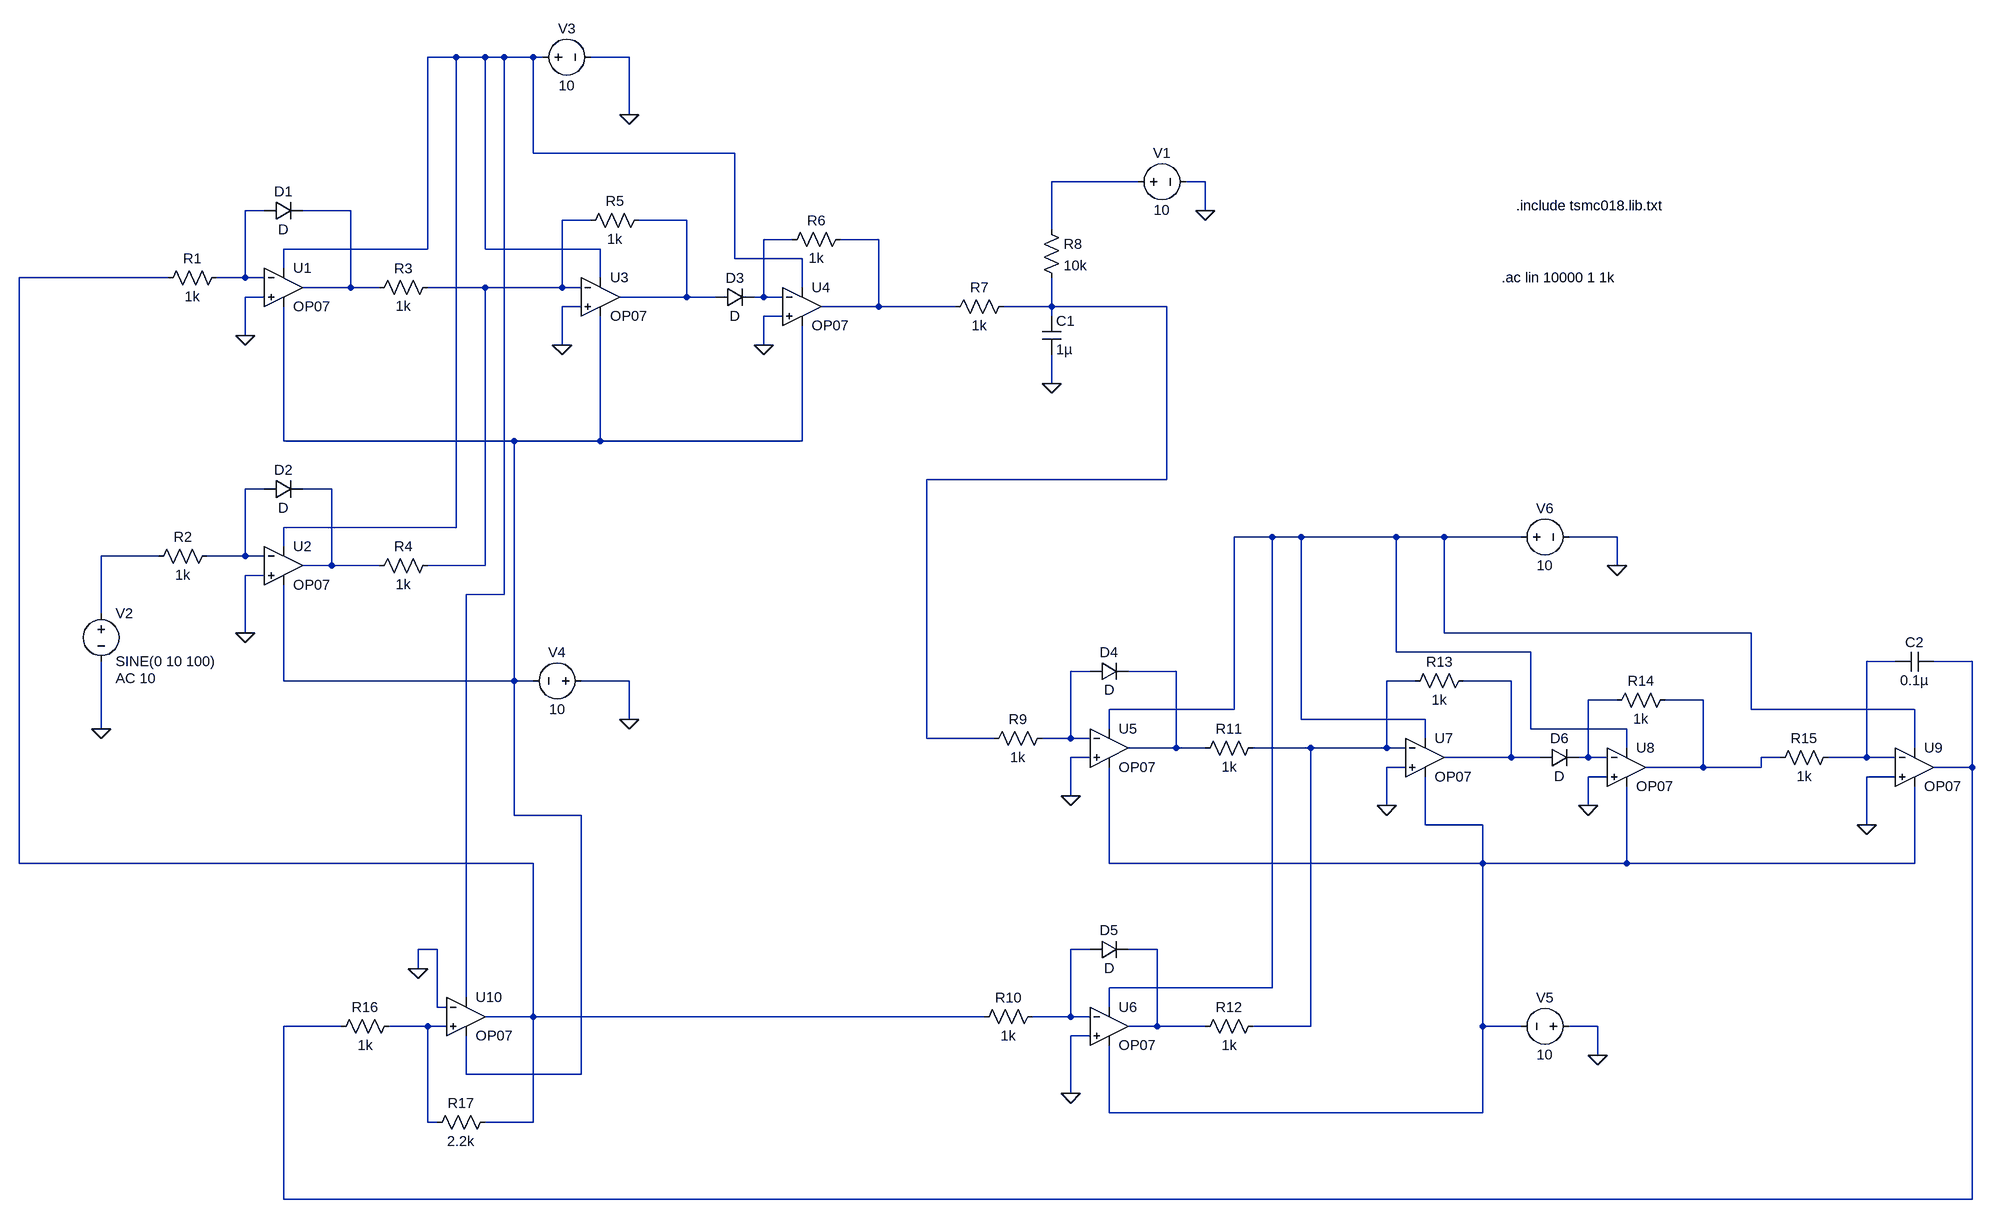
[diagram p0: schematic PLL Design Project.asc]
PLL Design Project.asc, the LTspice schematic file:
Version 4
SHEET 1 2996 1684
WIRE 352 -224 304 -224
WIRE 400 -224 352 -224
WIRE 432 -224 400 -224
WIRE 480 -224 432 -224
WIRE 496 -224 480 -224
WIRE 640 -224 576 -224
WIRE 640 -128 640 -224
WIRE 480 -64 480 -224
WIRE 816 -64 480 -64
WIRE 1488 -16 1344 -16
WIRE 1600 -16 1568 -16
WIRE 32 32 0 32
WIRE 176 32 96 32
WIRE 1600 32 1600 -16
WIRE 576 48 528 48
WIRE 736 48 656 48
WIRE 1344 64 1344 -16
WIRE 912 80 864 80
WIRE 1056 80 992 80
WIRE 304 96 304 -224
WIRE 304 96 64 96
WIRE 400 96 400 -224
WIRE 592 96 400 96
WIRE 816 112 816 -64
WIRE 928 112 816 112
WIRE 64 128 64 96
WIRE -128 144 -560 144
WIRE 0 144 0 32
WIRE 0 144 -48 144
WIRE 32 144 0 144
WIRE 592 144 592 96
WIRE 176 160 176 32
WIRE 176 160 96 160
WIRE 224 160 176 160
WIRE 400 160 304 160
WIRE 528 160 528 48
WIRE 528 160 400 160
WIRE 560 160 528 160
WIRE 928 160 928 112
WIRE 32 176 0 176
WIRE 736 176 736 48
WIRE 736 176 624 176
WIRE 784 176 736 176
WIRE 864 176 864 80
WIRE 864 176 848 176
WIRE 896 176 864 176
WIRE 560 192 528 192
WIRE 1056 192 1056 80
WIRE 1056 192 960 192
WIRE 1184 192 1056 192
WIRE 1344 192 1344 144
WIRE 1344 192 1264 192
WIRE 1536 192 1344 192
WIRE 896 208 864 208
WIRE 1344 208 1344 192
WIRE 0 240 0 176
WIRE 528 256 528 192
WIRE 864 256 864 208
WIRE 1344 320 1344 272
WIRE 64 416 64 192
WIRE 448 416 64 416
WIRE 592 416 592 208
WIRE 592 416 448 416
WIRE 928 416 928 224
WIRE 928 416 592 416
WIRE 1536 480 1536 192
WIRE 1536 480 1136 480
WIRE 32 496 0 496
WIRE 144 496 96 496
WIRE 352 560 352 -224
WIRE 352 560 64 560
WIRE 1712 576 1648 576
WIRE 1760 576 1712 576
WIRE 1920 576 1760 576
WIRE 2000 576 1920 576
WIRE 2128 576 2000 576
WIRE 2288 576 2208 576
WIRE 64 592 64 560
WIRE -144 608 -240 608
WIRE 0 608 0 496
WIRE 0 608 -64 608
WIRE 32 608 0 608
WIRE 144 624 144 496
WIRE 144 624 96 624
WIRE 224 624 144 624
WIRE 400 624 400 160
WIRE 400 624 304 624
WIRE 2288 624 2288 576
WIRE 32 640 0 640
WIRE 432 672 432 -224
WIRE 432 672 368 672
WIRE -240 704 -240 608
WIRE 0 736 0 640
WIRE 2000 736 2000 576
WIRE 2512 736 2000 736
WIRE 1920 768 1920 576
WIRE 2144 768 1920 768
WIRE 2752 784 2704 784
WIRE 2880 784 2816 784
WIRE 1408 800 1376 800
WIRE 1552 800 1472 800
WIRE 64 816 64 656
WIRE 448 816 448 416
WIRE 448 816 64 816
WIRE 480 816 448 816
WIRE 640 816 560 816
WIRE 1952 816 1904 816
WIRE 2112 816 2032 816
WIRE 2288 848 2240 848
WIRE 2432 848 2368 848
WIRE 1648 864 1648 576
WIRE 1648 864 1440 864
WIRE 2512 864 2512 736
WIRE 2784 864 2512 864
WIRE 640 880 640 816
WIRE 1760 880 1760 576
WIRE 1968 880 1760 880
WIRE -240 896 -240 784
WIRE 1440 896 1440 864
WIRE 2144 896 2144 768
WIRE 2304 896 2144 896
WIRE 1136 912 1136 480
WIRE 1248 912 1136 912
WIRE 1376 912 1376 800
WIRE 1376 912 1328 912
WIRE 1408 912 1376 912
WIRE 1968 912 1968 880
WIRE 1552 928 1552 800
WIRE 1552 928 1472 928
WIRE 1600 928 1552 928
WIRE 1776 928 1680 928
WIRE 1904 928 1904 816
WIRE 1904 928 1776 928
WIRE 1936 928 1904 928
WIRE 2304 928 2304 896
WIRE 2784 928 2784 864
WIRE 1408 944 1376 944
WIRE 2112 944 2112 816
WIRE 2112 944 2000 944
WIRE 2160 944 2112 944
WIRE 2240 944 2240 848
WIRE 2240 944 2224 944
WIRE 2272 944 2240 944
WIRE 2560 944 2528 944
WIRE 2704 944 2704 784
WIRE 2704 944 2640 944
WIRE 2752 944 2704 944
WIRE 1936 960 1904 960
WIRE 2432 960 2432 848
WIRE 2432 960 2336 960
WIRE 2528 960 2528 944
WIRE 2528 960 2432 960
WIRE 2880 960 2880 784
WIRE 2880 960 2816 960
WIRE 2272 976 2240 976
WIRE 2752 976 2704 976
WIRE 1376 1008 1376 944
WIRE 1904 1024 1904 960
WIRE 2240 1024 2240 976
WIRE 448 1040 448 816
WIRE 560 1040 448 1040
WIRE 1968 1056 1968 976
WIRE 2064 1056 1968 1056
WIRE 2704 1056 2704 976
WIRE -560 1120 -560 144
WIRE 480 1120 -560 1120
WIRE 1440 1120 1440 960
WIRE 2064 1120 2064 1056
WIRE 2064 1120 1440 1120
WIRE 2304 1120 2304 992
WIRE 2304 1120 2064 1120
WIRE 2784 1120 2784 992
WIRE 2784 1120 2304 1120
WIRE 320 1264 288 1264
WIRE 1408 1264 1376 1264
WIRE 1520 1264 1472 1264
WIRE 288 1296 288 1264
WIRE 1712 1328 1712 576
WIRE 1712 1328 1440 1328
WIRE 368 1344 368 672
WIRE 320 1360 320 1264
WIRE 336 1360 320 1360
WIRE 1440 1360 1440 1328
WIRE 480 1376 480 1120
WIRE 480 1376 400 1376
WIRE 1232 1376 480 1376
WIRE 1376 1376 1376 1264
WIRE 1376 1376 1312 1376
WIRE 1408 1376 1376 1376
WIRE 160 1392 64 1392
WIRE 304 1392 240 1392
WIRE 336 1392 304 1392
WIRE 1520 1392 1520 1264
WIRE 1520 1392 1472 1392
WIRE 1600 1392 1520 1392
WIRE 1776 1392 1776 928
WIRE 1776 1392 1680 1392
WIRE 2064 1392 2064 1120
WIRE 2128 1392 2064 1392
WIRE 2256 1392 2208 1392
WIRE 1408 1408 1376 1408
WIRE 2256 1440 2256 1392
WIRE 368 1472 368 1408
WIRE 560 1472 560 1040
WIRE 560 1472 368 1472
WIRE 1376 1504 1376 1408
WIRE 1440 1536 1440 1424
WIRE 2064 1536 2064 1392
WIRE 2064 1536 1440 1536
WIRE 304 1552 304 1392
WIRE 320 1552 304 1552
WIRE 480 1552 480 1376
WIRE 480 1552 400 1552
WIRE 64 1680 64 1392
WIRE 2880 1680 2880 960
WIRE 2880 1680 64 1680
FLAG 0 240 0
FLAG 0 736 0
FLAG 528 256 0
FLAG 864 256 0
FLAG 1344 320 0
FLAG 1600 32 0
FLAG 1376 1008 0
FLAG 1376 1504 0
FLAG 1904 1024 0
FLAG 2240 1024 0
FLAG 2704 1056 0
FLAG 288 1296 0
FLAG -240 896 0
FLAG 640 -128 0
FLAG 640 880 0
FLAG 2288 624 0
FLAG 2256 1440 0
SYMBOL res -32 128 R90
WINDOW 0 0 56 VBottom 2
WINDOW 3 32 56 VTop 2
SYMATTR InstName R1
SYMATTR Value 1k
SYMBOL OpAmps\\OP07 64 96 R0
SYMATTR InstName U1
SYMBOL OpAmps\\OP07 64 560 R0
SYMATTR InstName U2
SYMBOL res -48 592 R90
WINDOW 0 0 56 VBottom 2
WINDOW 3 32 56 VTop 2
SYMATTR InstName R2
SYMATTR Value 1k
SYMBOL diode 32 48 R270
WINDOW 0 32 32 VTop 2
WINDOW 3 0 32 VBottom 2
SYMATTR InstName D1
SYMBOL diode 32 512 R270
WINDOW 0 32 32 VTop 2
WINDOW 3 0 32 VBottom 2
SYMATTR InstName D2
SYMBOL res 320 144 R90
WINDOW 0 0 56 VBottom 2
WINDOW 3 32 56 VTop 2
SYMATTR InstName R3
SYMATTR Value 1k
SYMBOL res 320 608 R90
WINDOW 0 0 56 VBottom 2
WINDOW 3 32 56 VTop 2
SYMATTR InstName R4
SYMATTR Value 1k
SYMBOL OpAmps\\OP07 592 112 R0
SYMATTR InstName U3
SYMBOL res 672 32 R90
WINDOW 0 0 56 VBottom 2
WINDOW 3 32 56 VTop 2
SYMATTR InstName R5
SYMATTR Value 1k
SYMBOL diode 784 192 R270
WINDOW 0 32 32 VTop 2
WINDOW 3 0 32 VBottom 2
SYMATTR InstName D3
SYMBOL OpAmps\\OP07 928 128 R0
SYMATTR InstName U4
SYMBOL res 1008 64 R90
WINDOW 0 0 56 VBottom 2
WINDOW 3 32 56 VTop 2
SYMATTR InstName R6
SYMATTR Value 1k
SYMBOL res 1280 176 R90
WINDOW 0 0 56 VBottom 2
WINDOW 3 32 56 VTop 2
SYMATTR InstName R7
SYMATTR Value 1k
SYMBOL cap 1328 208 R0
SYMATTR InstName C1
SYMATTR Value 1µ
SYMBOL res 1328 48 R0
SYMATTR InstName R8
SYMATTR Value 10k
SYMBOL voltage 1472 -16 R270
WINDOW 0 32 56 VTop 2
WINDOW 3 -32 56 VBottom 2
WINDOW 123 0 0 Left 0
WINDOW 39 0 0 Left 0
SYMATTR InstName V1
SYMATTR Value 10
SYMBOL res 1344 896 R90
WINDOW 0 0 56 VBottom 2
WINDOW 3 32 56 VTop 2
SYMATTR InstName R9
SYMATTR Value 1k
SYMBOL OpAmps\\OP07 1440 864 R0
SYMATTR InstName U5
SYMBOL OpAmps\\OP07 1440 1328 R0
SYMATTR InstName U6
SYMBOL res 1328 1360 R90
WINDOW 0 0 56 VBottom 2
WINDOW 3 32 56 VTop 2
SYMATTR InstName R10
SYMATTR Value 1k
SYMBOL diode 1408 816 R270
WINDOW 0 32 32 VTop 2
WINDOW 3 0 32 VBottom 2
SYMATTR InstName D4
SYMBOL diode 1408 1280 R270
WINDOW 0 32 32 VTop 2
WINDOW 3 0 32 VBottom 2
SYMATTR InstName D5
SYMBOL res 1696 912 R90
WINDOW 0 0 56 VBottom 2
WINDOW 3 32 56 VTop 2
SYMATTR InstName R11
SYMATTR Value 1k
SYMBOL res 1696 1376 R90
WINDOW 0 0 56 VBottom 2
WINDOW 3 32 56 VTop 2
SYMATTR InstName R12
SYMATTR Value 1k
SYMBOL OpAmps\\OP07 1968 880 R0
SYMATTR InstName U7
SYMBOL res 2048 800 R90
WINDOW 0 0 56 VBottom 2
WINDOW 3 32 56 VTop 2
SYMATTR InstName R13
SYMATTR Value 1k
SYMBOL diode 2160 960 R270
WINDOW 0 32 32 VTop 2
WINDOW 3 0 32 VBottom 2
SYMATTR InstName D6
SYMBOL OpAmps\\OP07 2304 896 R0
SYMATTR InstName U8
SYMBOL res 2384 832 R90
WINDOW 0 0 56 VBottom 2
WINDOW 3 32 56 VTop 2
SYMATTR InstName R14
SYMATTR Value 1k
SYMBOL res 2656 928 R90
WINDOW 0 0 56 VBottom 2
WINDOW 3 32 56 VTop 2
SYMATTR InstName R15
SYMATTR Value 1k
SYMBOL OpAmps\\OP07 2784 896 R0
SYMATTR InstName U9
SYMBOL cap 2752 800 R270
WINDOW 0 32 32 VTop 2
WINDOW 3 0 32 VBottom 2
SYMATTR InstName C2
SYMATTR Value 0.1µ
SYMBOL OpAmps\\OP07 368 1312 R0
SYMATTR InstName U10
SYMBOL res 256 1376 R90
WINDOW 0 0 56 VBottom 2
WINDOW 3 32 56 VTop 2
SYMATTR InstName R16
SYMATTR Value 1k
SYMBOL res 416 1536 R90
WINDOW 0 0 56 VBottom 2
WINDOW 3 32 56 VTop 2
SYMATTR InstName R17
SYMATTR Value 2.2k
SYMBOL voltage -240 688 R0
WINDOW 123 24 124 Left 2
WINDOW 39 0 0 Left 0
SYMATTR InstName V2
SYMATTR Value SINE(0 10 100)
SYMATTR Value2 AC 10
SYMBOL voltage 480 -224 R270
WINDOW 0 32 56 VTop 2
WINDOW 3 -32 56 VBottom 2
WINDOW 123 0 0 Left 0
WINDOW 39 0 0 Left 0
SYMATTR InstName V3
SYMATTR Value 10
SYMBOL voltage 576 816 R90
WINDOW 0 -32 56 VBottom 2
WINDOW 3 32 56 VTop 2
WINDOW 123 0 0 Left 0
WINDOW 39 0 0 Left 0
SYMATTR InstName V4
SYMATTR Value 10
SYMBOL voltage 2224 1392 R90
WINDOW 0 -32 56 VBottom 2
WINDOW 3 32 56 VTop 2
WINDOW 123 0 0 Left 0
WINDOW 39 0 0 Left 0
SYMATTR InstName V5
SYMATTR Value 10
SYMBOL voltage 2112 576 R270
WINDOW 0 32 56 VTop 2
WINDOW 3 -32 56 VBottom 2
WINDOW 123 0 0 Left 0
WINDOW 39 0 0 Left 0
SYMATTR InstName V6
SYMATTR Value 10
TEXT 2120 24 Left 2 !.include tsmc018.lib.txt
TEXT 2096 144 Left 2 !.ac lin 10000 1 1k

The netlist it stands for:
* PLL Design Project.asc
R1 N003 N009 1k
XU1 0 N003 N001 N011 N004 LT1001  ; OP07, pins In+ In- V+ V- OUT
XU2 0 N012 N001 N011 N013 LT1001  ; OP07, pins In+ In- V+ V- OUT
R2 N012 N015 1k
D1 N003 N004 D
D2 N012 N013 D
R3 N005 N004 1k
R4 N005 N013 1k
XU3 0 N005 N001 N011 N006 LT1001  ; OP07, pins In+ In- V+ V- OUT
R5 N006 N005 1k
D3 N006 N007 D
XU4 0 N007 N001 N011 N008 LT1001  ; OP07, pins In+ In- V+ V- OUT
R6 N008 N007 1k
R7 N010 N008 1k
C1 N010 0 1µ
R8 N002 N010 10k
V1 N002 0 10
R9 N018 N010 1k
XU5 0 N018 N014 N024 N019 LT1001  ; OP07, pins In+ In- V+ V- OUT
XU6 0 N025 N014 N024 N026 LT1001  ; OP07, pins In+ In- V+ V- OUT
R10 N025 N009 1k
D4 N018 N019 D
D5 N025 N026 D
R11 N020 N019 1k
R12 N020 N026 1k
XU7 0 N020 N014 N024 N021 LT1001  ; OP07, pins In+ In- V+ V- OUT
R13 N021 N020 1k
D6 N021 N022 D
XU8 0 N022 N014 N024 N023 LT1001  ; OP07, pins In+ In- V+ V- OUT
R14 N023 N022 1k
R15 N016 N023 1k
XU9 0 N016 N014 N024 N017 LT1001  ; OP07, pins In+ In- V+ V- OUT
C2 N016 N017 0.1µ
XU10 N027 0 N001 N011 N009 LT1001  ; OP07, pins In+ In- V+ V- OUT
R16 N027 N017 1k
R17 N009 N027 2.2k
V2 N015 0 SINE(0 10 100) AC 10
V3 N001 0 10
V4 0 N011 10
V5 0 N024 10
V6 N014 0 10
.model D D
.lib standard.dio
.include tsmc018.lib.txt
.ac lin 10000 1 1k
.lib LTC.lib
.backanno
.end